# EAGLE design dlock13 (EAGLE 6.4)
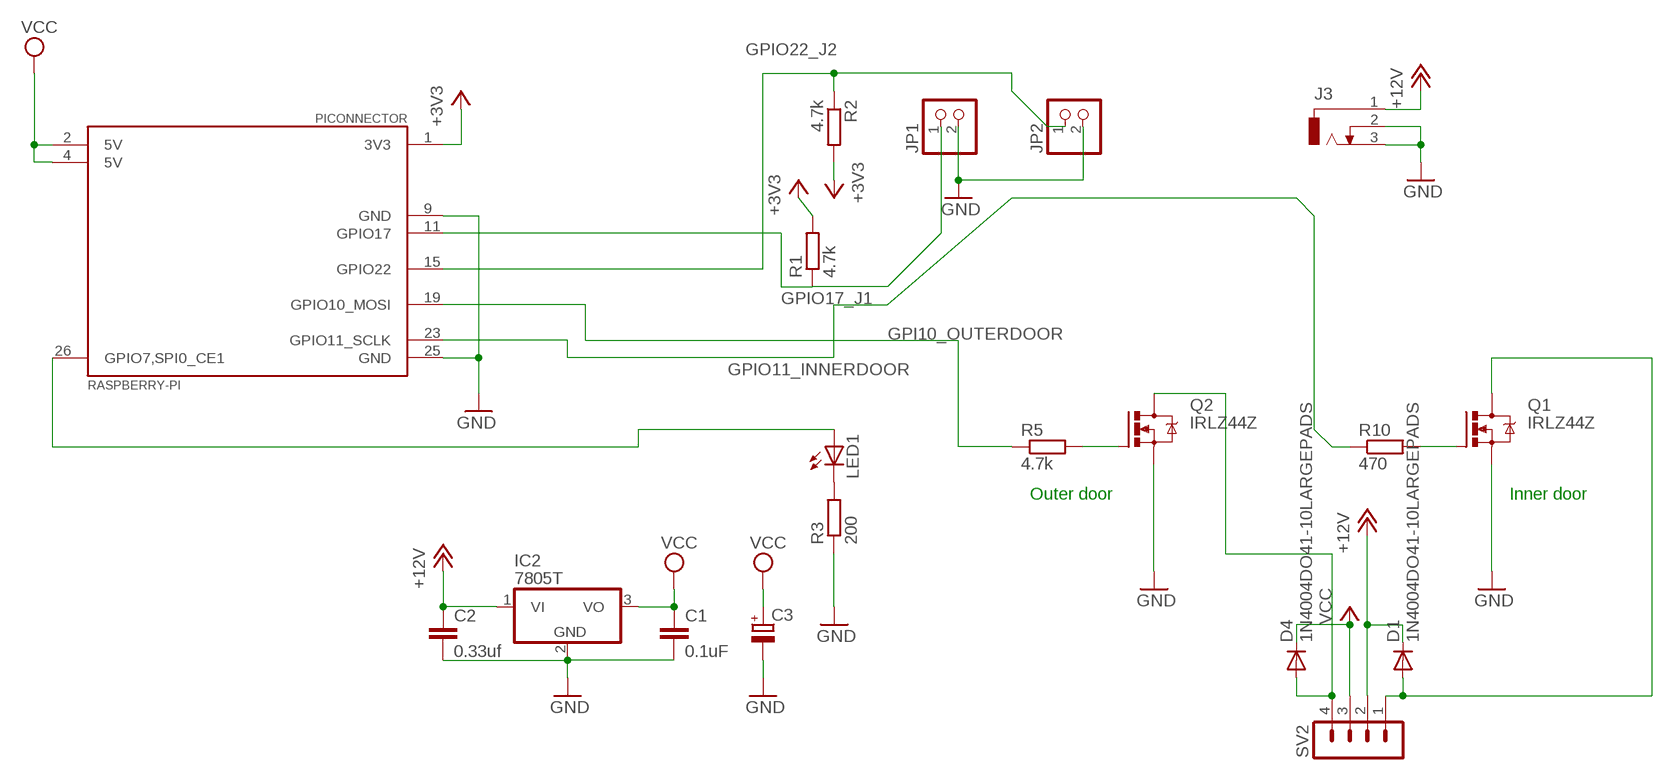
[diagram p0: schematic, sheet 1]

## Parts
C1  0.1uF  CC2.5-3LARGEPADS  [C2.5-3]
C2  0.33uf  CC2.5-3LARGEPADS  [C2.5-3]
C3  CPOL-EUE1,8-4LARGEPADS  [E1,8-4]
D1  1N4004DO41-10LARGEPADS  [DO41-10]
D4  1N4004DO41-10LARGEPADS  [DO41-10]
IC2  7805T  [TO220H]
J3  DCJ0303DCJ0303LARGEPADS  [DCJ0303]
JP1  PINHD-1X2  [1X02]
JP2  PINHD-1X21X02LARGEPADS  [1X02]
LED1  LEDLED5MMLARGEPADS  [LED5MM]
PICONNECTOR  RASPBERRY-PI  RASPBERRY-PI_REV1PIWITHPADSREMOVED  [RASPBERRY-PI_REV1]
Q1  IRLZ44Z  [TO220BH]
Q2  IRLZ44Z  [TO220BH]
R1  4.7k  R-EU_0207/10LARGEPADS  [0207/10]
R2  4.7k  R-EU_0207/10LARGEPADS  [0207/10]
R3  200  R-EU_0207/10LARGEPADS  [0207/10]
R5  4.7k  R-EU_0207/10LARGEPADS  [0207/10]
R10  470  R-EU_0207/10LARGEPADS  [0207/10]
SV2  MA04-1MA04-1LARGEPADS  [MA04-1]

## Nets
+3V3: PICONNECTOR.1(3V3) R1.2 R2.2
+12V: C2.1 D1.C IC2.1(VI) J3.1 SV2.2
GND: C1.2 C2.2 C3.- IC2.2(GND) J3.2 J3.3 JP1.2 JP2.2 PICONNECTOR.9(GND) PICONNECTOR.25(GND) Q1.S Q2.S R3.1
GPI10_OUTERDOOR: PICONNECTOR.19(GPIO10_MOSI) R5.1
GPIO11_INNERDOOR: PICONNECTOR.23(GPIO11_SCLK) R10.1
GPIO17_J1: JP1.1 PICONNECTOR.11(GPIO17) R1.1
GPIO22_J2: JP2.1 PICONNECTOR.15(GPIO22) R2.1
N$2: D1.A Q1.D SV2.1
N$4: Q1.G R10.2
N$7: Q2.G R5.2
N$11: LED1.K(C) R3.2
N$13: LED1.A PICONNECTOR.26(GPIO7,SPI0_CE1)
N$14: D4.A Q2.D SV2.4
VCC: C1.1 C3.+ D4.C IC2.3(VO) PICONNECTOR.2(5V) PICONNECTOR.4(5V) SV2.3

## Notes on the sheet
- Outer door | Inner door

## Library data of the parts
C1 C2 = capacitor-wima:C: CAPACITOR naming: grid - package width
C3 = rcl:CPOL-EU: POLARIZED CAPACITOR, European symbol
D1 D4 = diode:1N4004: DIODE general purpose rectifier, 1 A, Large pads for manual soldering
IC2 = linear:78*: Positive VOLTAGE REGULATOR Source: http://cache.national.com/ds/LM/LM78L05.pdf http://www.fairchildsemi.com/ds/LM/LM7805.pdf
J3 = con-jack:DCJ0303: DC POWER JACK Source: DCJ0303.pdf
JP1 JP2 = pinhead:PINHD-1X2: PIN HEADER
LED1 = led:LED: LED OSRAM: - CHIPLED LG R971, LG N971, LY N971, LG Q971, LY Q971, LO R971, LY R971 LH N974, LH R974 LS Q976, LO Q976, LY Q976 LO Q996 - Hyper CHIPLED LW Q18S LB Q993, LB Q99A, LB R99A - SideLED LS A670, LO A670, LY A670, LG A670, LP A670 LB A673, LV A673, LT A673, LW A673 LH A674 LY A675 LS A676, LA A676, LO A676, LY A676, LW A676 LS A679, LY A679, LG A679 - Hyper Micro SIDELED® LS Y876, LA Y876, LO Y876, LY Y876 LT Y87S - SmartLED LW L88C, LW L88S LB L89C, LB L89S, LG L890 LS L89K, LO L89K, LY L89K LS L896, LA L896, LO L896, LY L896 - TOPLED LS T670, LO T670, LY T670, LG T670, LP T670 LSG T670, LSP T670, LSY T670, LOP T670, LYG T670 LG T671, LOG T671, LSG T671 LB T673, LV T673, LT T673, LW T673 LH T674 LS T676, LA T676, LO T676, LY T676, LB T676, LH T676, LSB T676, LW T676 LB T67C, LV T67C, LT T67C, LS T67K, LO T67K, LY T67K, LW E67C LS E67B, LA E67B, LO E67B, LY E67B, LB E67C, LV E67C, LT E67C LW T67C LS T679, LY T679, LG T679 LS T770, LO T770, LY T770, LG T770, LP T770 LB T773, LV T773, LT T773, LW T773 LH T774 LS E675, LA E675, LY E675, LS T675 LS T776, LA T776, LO T776, LY T776, LB T776 LHGB T686 LT T68C, LB T68C - Hyper Mini TOPLED® LB M676 - Mini TOPLED Santana® LG M470 LS M47K, LO M47K, LY M47K Source: http://www.osram.convergy.de LUXEON: - LUMILED® LXK2-PW12-R00, LXK2-PW12-S00, LXK2-PW14-U00, LXK2-PW14-V00 LXK2-PM12-R00, LXK2-PM12-S00, LXK2-PM14-U00 LXK2-PE12-Q00, LXK2-PE12-R00, LXK2-PE12-S00, LXK2-PE14-T00, LXK2-PE14-U00 LXK2-PB12-K00, LXK2-PB12-L00, LXK2-PB12-M00, LXK2-PB14-N00, LXK2-PB14-P00, LXK2-PB14-Q00 LXK2-PR12-L00, LXK2-PR12-M00, LXK2-PR14-Q00, LXK2-PR14-R00 LXK2-PD12-Q00, LXK2-PD12-R00, LXK2-PD12-S00 LXK2-PH12-R00, LXK2-PH12-S00 LXK2-PL12-P00, LXK2-PL12-Q00, LXK2-PL12-R00 Source: www.luxeon.com KINGBRIGHT: KA-3528ASYC Source: www.kingbright.com
PICONNECTOR = RaspberryPi:RASPBERRY-PI_REV1: Raspberry Pi Board <http://www.raspberrypi.org/> Jacques Lagnel V1.0 (beta) 2012 Mateusz Bawaj V1.1 (beta) 2012 Board dimension: Forum 3D model <http://www.raspberrypi.org/forum/general-discussion/mechanical-profile-3d-models?value=3d%20model&type=1&include=1&search=1&ret=all> The GPIO Connector (P1): http://elinux.org/RPi_Low-level_peripherals
Q1 Q2 = transistor-power:IRLZ44Z: N-Channel HEXFET® Power MOSFET Logic Level AUTOMOTIVE MOSFET Source: http://www.irf.com/product-info/datasheets/data/irlz44zpbf.pdf
R1-R3 R5 R10 = rcl:R-EU_: RESISTOR, European symbol
SV2 = con-lstb:MA04-1: PIN HEADER

## Net classes
0 default: width 1.016 mm, clearance 0.355 mm
1 power: width 1 mm, clearance 0.355 mm to class 0, clearance 0.355 mm

## Board
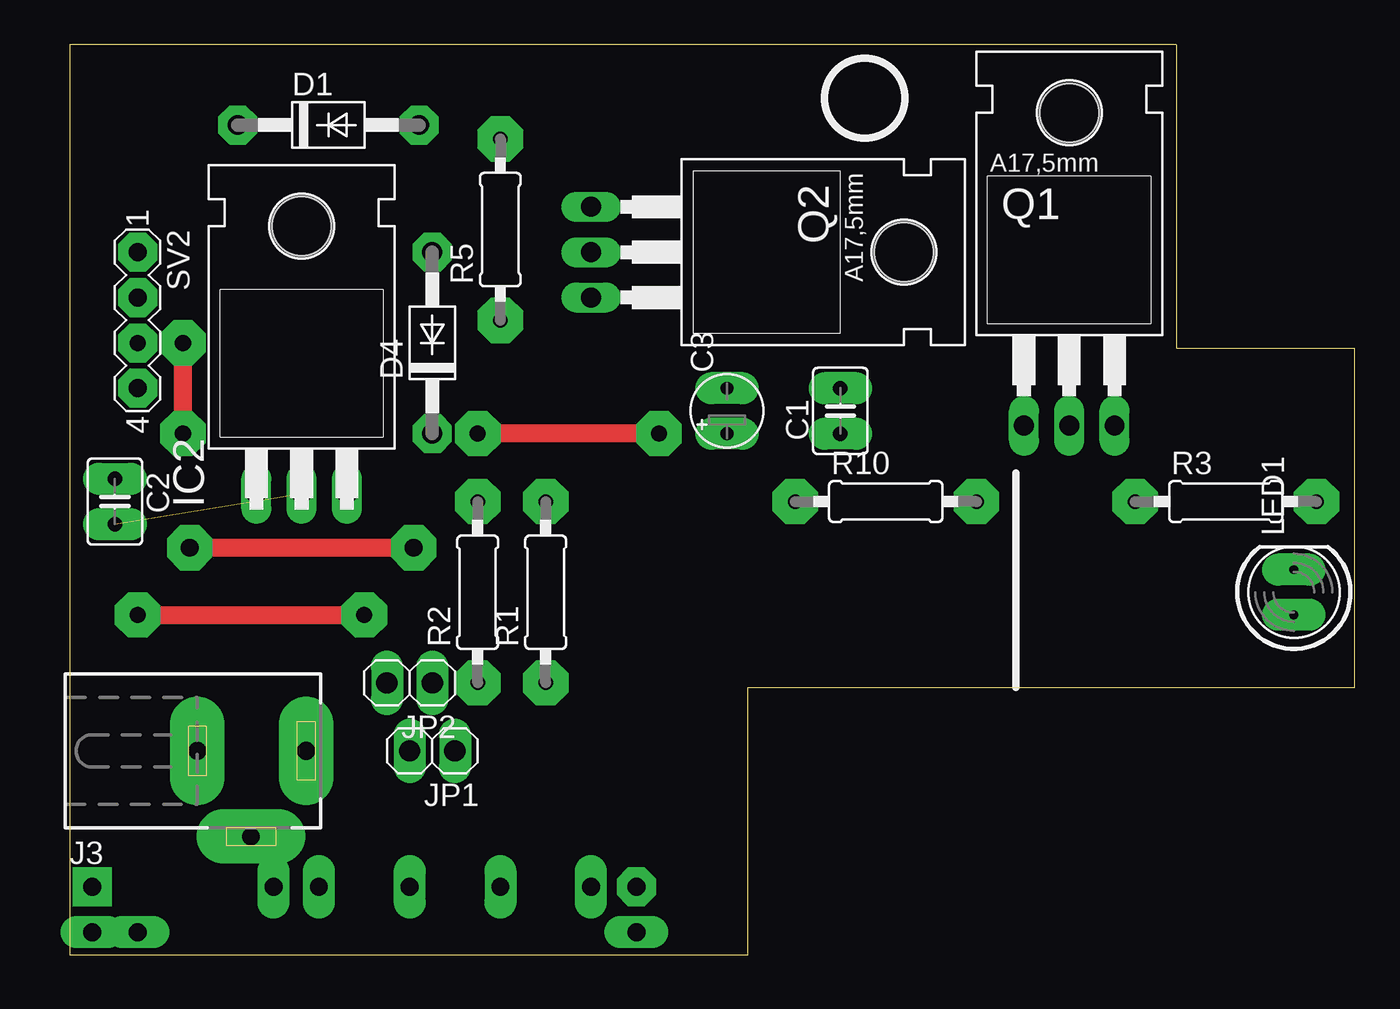
[diagram p1: board, top side]
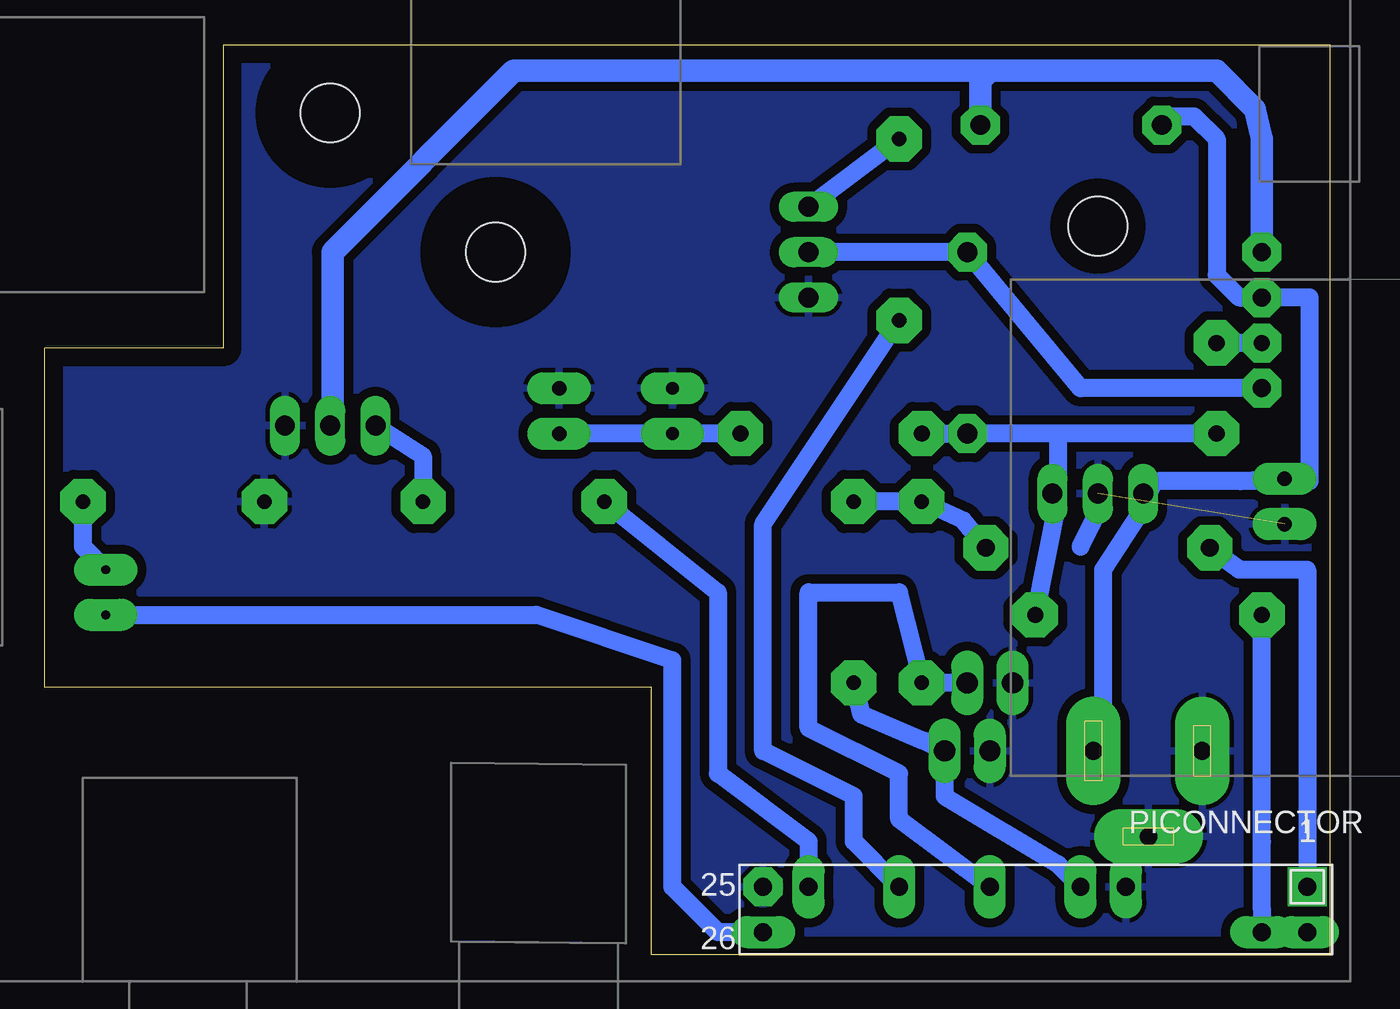
[diagram p2: board, bottom side, seen from below]

Size 72 x 51 mm. Coordinates in mm from the lower left corner, seen from the top.
Outline: 72,15 72,34 62,34 62,51 0,51 0,0 38,0 38,15 72,15
Copper layers (1*16): Top 0.035mm / dielectric 1.5mm / Bottom 0.035mm
Design rules "default *": minimum track width 10mil, minimum drill 24mil, track to track 20mil, track to pad 18mil, pad to pad 20mil, via to via 20mil, smd to smd 8mil, copper to edge 40mil, drill to drill 8mil, minimum pad ring 10mil, minimum via ring 8mil, stop-mask expansion 4mil, vias tented up to drill 0mil, thermal gap 10mil

### Footprints (pad centres in the part's own frame; a part is rotated, then mirrored left to right if it is on the bottom)
C2.5-3 = drill 0.813 pad 1.778 long: 1 -1.27,0; 2 1.27,0
E1,8-4 = drill 0.711 pad 1.778 long: + -1.27,0; - 1.27,0
DO41-10 = drill 1.118 pad 2.184 octagon: A 5.08,0; C -5.08,0
TO220H = drill 1.118 long: 1 -2.54,-10.16; 2 0,-10.16; 3 2.54,-10.16 | hole 3.302: 0,4.826
DCJ0303 = drill 1 pad 3.048 long: 1 0,3.1; 2 4.8,0; 3 0,-3
1X02 = drill 1.2 long: 1 -1.27,0; 2 1.27,0
LED5MM = drill 0.483 pad 1.778 long: A -1.27,0; K 1.27,0
RASPBERRY-PI_REV1 = drill 1 pad 2.184 square: 1 -46.99,-20.32 | drill 1 pad 1.778 long: 2 -46.99,-22.86; 4 -44.45,-22.86; 9 -36.83,-20.32; 11 -34.29,-20.32; 15 -29.21,-20.32; 19 -24.13,-20.32; 23 -19.05,-20.32; 26 -16.51,-22.86 | drill 1 pad 2.184 octagon: 25 -16.51,-20.32
TO220BH = drill 1.118 long: D 0,-6.35; G -2.54,-6.35; S 2.54,-6.35 | hole 3.302: 0,11.176
0207/10 = drill 0.813 pad 2.54 octagon: 1 -5.08,0; 2 5.08,0
MA04-1 = drill 1.016 pad 2.184 octagon: 1 -3.81,0; 2 -1.27,0; 4 3.81,0 | drill 0.9 pad 2.184 octagon: 3 1.27,0

### Placement (x,y rotation side)
C1  43.18,30.48 90 top
C2  2.54,25.4 270 top
C3  36.83,30.48 90 top
D1  14.5,46.5 0 top
D4  20.32,34.29 90 top
IC2  13,36 0 top
J3  10.16,11.43 270 top
JP1  20.32,11.43 180 top
JP2  19.05,15.24 180 top
LED1  68.58,20.32 90 top
PICONNECTOR  48.26,24.13 0 top
Q1  56,36 0 top
Q2  35.56,39.37 270 top
R1  26.67,20.32 90 top
R2  22.86,20.32 90 top
R3  64.77,25.4 0 top
R5  24.13,40.64 90 top
R10  45.72,25.4 0 top
SV2  3.81,35.56 270 top

### Tracks (layer width: path | path; a pad name or v marks a point on that pad's centre or on a via)
+3V3  (via drill 1 pad 2.54)
  Top 1.016: v19.27,22.81 v6.73,22.81
  Bottom 1.016: v6.73,22.81 5.08,21.59 1.27,21.59 PICONNECTOR.1 | v19.27,22.81 20.54,24.35 R2.2 R1.2
+12V
  Bottom 0.61: 9.62,26.54 10.24,25.36 IC2.1
  Bottom 1.016: 5,26.54 9.62,26.54 | SV2.2 1.14,36.83 1.14,26.54 5,26.54 | C2.1 5,26.54 | D1.C 8.93,46.99 7.62,46.99 6.35,45.72 6.35,38.1 5.08,36.83 SV2.2 | 3.57,37.07 SV2.2 | J3.1 12.7,12.7 12.7,21.59 10.24,25.36
GND  (1 unrouted)
  pour Bottom: -2.54,53.34 74.93,53.34 74.93,-2.54 -2.54,-2.54
GPI10_OUTERDOOR
  Bottom 1.016: R5.1 31.75,24.13 31.75,11.43 26.67,8.89 26.67,6.35 PICONNECTOR.19
GPIO11_INNERDOOR
  Bottom 1.016: R10.1 34.29,20.32 34.29,10.16 29.21,6.35 PICONNECTOR.23
GPIO17_J1
  Bottom 1.016: R1.1 26.27,13.5 22.73,12 JP1.1 21.59,8.89 15.24,5.08 PICONNECTOR.11
GPIO22_J2
  Bottom 1.016: JP2.1 R2.1 24.13,20.32 29.21,20.32 29.21,12.7 24.13,10.16 24.13,7.62 PICONNECTOR.15
N$2
  Bottom 1.27: SV2.1 3.81,45.72 4.2,47.38 6.35,49.53 19.05,49.53 | 19.05,49.53 45.72,49.53 55.88,39.37 55.88,29.77 Q1.D | D1.A 19.58,49 19.05,49.53
N$4
  Bottom 1.016: Q1.G 50.8,27.94 R10.2
N$7
  Bottom 1.016: R5.2 Q2.G
N$11
  Bottom 1.016: LED1.K 69.85,22.86 R3.2
N$13
  Bottom 1.016: LED1.A 44.45,19.05 36.83,16.51 36.83,3.81 34.29,1.27 PICONNECTOR.26
N$14
  Bottom 1.016: SV2.4 13.97,31.75 D4.A Q2.D
N$15
  Bottom 1.016: 13.97,22.86 12.7,25.4
VCC  (via drill 0.9 pad 2.54)
  Top 1.016: v6.35,34.29 v6.35,29.21 | v33.02,29.21 v22.86,29.21 | v3.81,19.05 v16.51,19.05
  Bottom 0.254: 15.24,25.4 15.54,25.7 IC2.3
  Bottom 1.016: 6.35,34.53 v6.35,34.29 SV2.3 | v6.35,29.21 15.24,29.21 | 15.24,29.21 15.24,26.14 IC2.3 | v22.86,29.21 D4.C 15.24,29.21 | v33.02,29.21 C3.+ C1.1 | v3.81,19.05 3.81,6.35 3.81,2.54 PICONNECTOR.4 PICONNECTOR.2 | v16.51,19.05 15.24,25.4